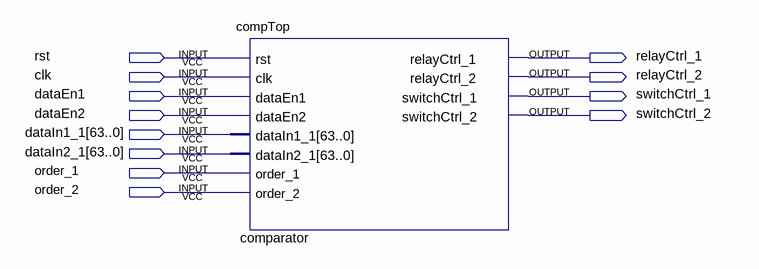
[diagram p0: schematic sheet]
// Quartus schematic busComparator.bdf as structural Verilog: 1 symbols, 12 pins
module busComparator (
  input  rst,
  input  clk,
  input  dataEn1,
  input  dataEn2,
  input  [63:0] dataIn1_1,
  input  [63:0] dataIn2_1,
  input  order_1,
  input  order_2,
  output relayCtrl_1,
  output relayCtrl_2,
  output switchCtrl_1,
  output switchCtrl_2
);

  compTop comparator (
    .rst(rst), .clk(clk), .dataEn1(dataEn1), .dataEn2(dataEn2), .dataIn1_1(dataIn1_1), .dataIn2_1(dataIn2_1),
    .order_1(order_1), .order_2(order_2), .relayCtrl_1(relayCtrl_1), .relayCtrl_2(relayCtrl_2),
    .switchCtrl_1(switchCtrl_1), .switchCtrl_2(switchCtrl_2));
endmodule
